# Altium schematic sheet Reader.SchDoc
size A4; SheetNumber: 2; SheetTotal: 4
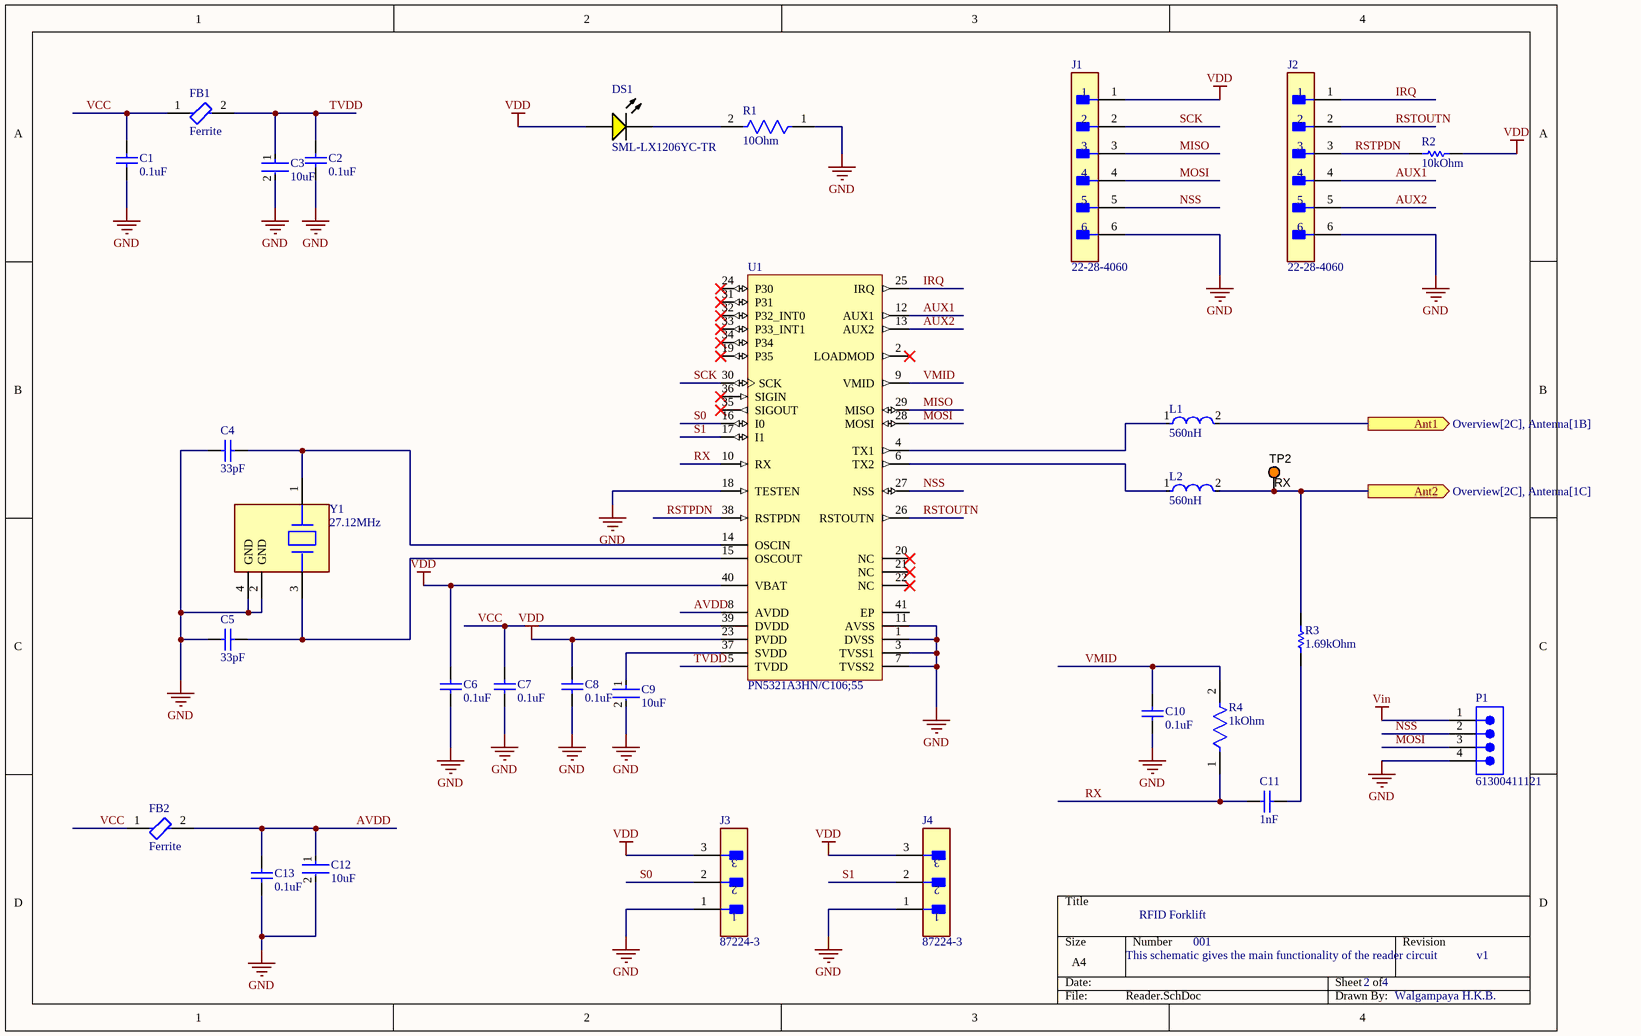
[diagram p0: Reader.SchDoc]

## Parts
C1  0.1uF  [CAPC2013X140X50LL20T25]
C2  0.1uF  [CAPC2013X140X50LL20T25]
C3  10uF  [FP-CC1206-0_3-1_45-IPC_C]
C4  33pF  [CAPC1608X90X35NL10T15]
C5  33pF  [CAPC1608X90X35NL10T15]
C6  0.1uF  [CAPC2013X140X50LL20T25]
C7  0.1uF  [CAPC2013X140X50LL20T25]
C8  0.1uF  [CAPC2013X140X50LL20T25]
C9  10uF  [FP-CC1206-0_3-1_45-IPC_C]
C10  0.1uF  [CAPC2013X140X50LL20T25]
C11  1nF  [CAPC2013X140X50LL20T25]
C12  10uF  [FP-CC1206-0_3-1_45-IPC_C]
C13  0.1uF  [CAPC2013X140X50LL20T25]
DS1  SML-LX1206YC-TR  [LUMX-SML-LX1206YC-TR_V]
FB1  Ferrite  [FP-BLM21-0_2-t0_85-e0_5-MFG]
FB2  Ferrite  [FP-BLM21-0_2-t0_85-e0_5-MFG]
J1  22-28-4060  [FP-22-28-4060-MFG]
J2  22-28-4060  [FP-22-28-4060-MFG]
J3  87224-3  [FP-87224-3-MFG]
J4  87224-3  [FP-87224-3-MFG]
L1  560nH  [FP-LQM18FN_00-IPC_C]
L2  560nH  [FP-LQM18FN_00-IPC_C]
P1  61300411121  [61300411121]
R1  10Ohm  [FP-RC0603-0_55-IPC_C]
R2  10kOhm  [RESC2013X60X35NL10T20]
R3  1.69kOhm  [RESC3116X65X40ML10T20]
R4  1kOhm  [FP-RC0603-0_55-IPC_C]
TP2  RX  [KSTN-5003]
U1  PN5321A3HN/C106;55  [NXP-HVQFN-40_L]
Y1  27.12MHz  [FP-ABM8-MFG]

## Ports
Ant1 (out, see Overview[2C], Antenna[1B]), Ant2 (out, see Overview[2C], Antenna[1C])

## Nets
GND: C1.1 C2.1 C3.2 C4.1 C5.1 C6.1 C7.1 C8.1 C9.2 C10.1 C12.2 C13.1 J1.6 J2.6 J3.1 J4.1 P1.4 R1.1 U1.1(DVSS) U1.3(TVSS1) U1.7(TVSS2) U1.11(AVSS) U1.18(TESTEN) Y1.2(GND) Y1.4(GND)
VDD: C6.2 C8.2 DS1.1(A) J1.1 J3.3 J4.3 R2.2 U1.23(PVDD) U1.40(VBAT)
Vin: P1.1
Ant1: L1.2 ; port Ant1
Ant2: L2.2 R3.2 TP2.1 ; port Ant2
AUX1: J2.4 U1.12(AUX1)
AUX2: J2.5 U1.13(AUX2)
AVDD: C12.1 C13.2 FB2.2 U1.8(AVDD)
IRQ: J2.1 U1.25(IRQ)
MISO: J1.3 U1.29(MISO)
MOSI: J1.4 P1.3 U1.28(MOSI)
NSS: J1.5 P1.2 U1.27(NSS)
RSTOUTN: J2.2 U1.26(RSTOUTN)
RSTPDN: J2.3 R2.1 U1.38(RSTPDN)
RX: C11.2 R4.1 U1.10(RX)
S0: J3.2 U1.16(I0)
S1: J4.2 U1.17(I1)
SCK: J1.2 U1.30(SCK)
TVDD: C2.2 C3.1 FB1.2 U1.5(TVDD)
VCC: C1.2 C7.2 FB1.1 FB2.1 U1.39(DVDD)
VMID: C10.2 R4.2 U1.9(VMID)
NetC4_2: C4.2 U1.14(OSCIN) Y1.1
NetC5_2: C5.2 U1.15(OSCOUT) Y1.3
NetC9_1: C9.1 U1.37(SVDD)
NetC11_1: C11.1 R3.1
NetDS1_2: DS1.2(K) R1.2
NetL1_1: L1.1 U1.4(TX1)
NetL2_1: L2.1 U1.6(TX2)

Not connected (* = marked no-connect by the designer): U1 2(LOADMOD)* 19(P35)* 20(NC)* 21(NC)* 22(NC)* 24(P30)* 31(P31)* 32(P32_INT0)* 33(P33_INT1)* 34(P34)* 35(SIGOUT)* 36(SIGIN)* 41(EP)

## Notes on the sheet
- RFID Forklift
- This schematic gives the main functionality of the reader circuit
- 001
- 2
- 4
- v1
- Walgampaya H.K.B.

## Library data of the parts
C1 C2 C6-C8 C10 C11 C13 = CMP-2007-04699-1: 08055C221KAT2A / 0805; Manufacturer: AVX Interconnect / Elco; Part Number: 08055C221KAT2A
C3 C9 C12 = CMP-2000-05436-2: CAP CER 1000PF 2KV X7R 1206; Capacitance: 1nF; Insulation Resistance: 10GR; Dissipation Factor: 2.5%; Tolerance: 10%; Termination: SMD/SMT; Voltage Rating (DC): 2kV; Case/Package: 1206; Length: 3.2mm; Depth: 1.6mm; Case Code (Imperial): 1206; Package Quantity: 1; Packaging: Tape and Reel; Dielectric: X7R; Mount: Surface Mount; Max Operating Temperature: 125°C; Lead Free: Lead Free; Number of Pins: 2; Thickness: 0.057inch; Width: 0.063inch; Resistor Type: Ceramic; Series: CC; RoHS Compliant: Yes; Voltage Rating: 2kV; Radiation Hardening: No; Construction: Flat; Height: 1.25mm; Min Operating Temperature: -55°C; Voltage: 2kV; Case Code (Metric): 3216
C4 C5 = CMP-2006-02655-1: 0603; Part Number: GRM1885C1H330GA01D; Manufacturer: Murata
DS1 = CMP-2000-07124-1: Yellow LED, Water Clear Len, 585 nm, 2.1 V, -40 to 85 degC, 2-Pin SMD, RoHS, Tape and Reel; Manufacturer: Lumex; Product Training Modules: LEDsBenefitsofCustomLEDandLCDTechnology; Millicandela Rating: 6mcd; Catalog Drawings: SML-LX1206SeriesTopSML-LX1206SeriesSideSML-LX1206SeriesBottomSML-LX1206SeriesFootprint; Wavelength - Peak: 585nm; Other Names: 67-1358-2LU60357TRSMLLX1206YCTR; Lens Style/Size: RectanglewithFlatTop; Current - Test: 20mA; Lens Color: Colorless; Viewing Angle: 160°; Voltage - Forward (Vf) (Typ): 2.1V; Online Catalog: SML-LX1206RectanglewithFlatTop1206PackageLEDs; Mounting Type: SurfaceMount; Package Description: 2-Pin Surface Mount Device, Body 3.2 x 1.5 mm; Datasheet Version: Rev. K, 08/2012; Features: -; Color: Yellow; RoHS Information: RoHSCertofCompliance; Package Reference: SML-LX1206YC-TR; Supplier Device Package: 1206; Standard Package: 3,000; Series: -; Wavelength - Dominant: -; Package / Case: 1206(3216Metric); Mounting Technology: SurfaceMount; Height (Max): 1.10mm; Lens Transparency: Clear; Datasheet URL: http://www.lumex.com/content/files/ProductAttachment/SML-LX1206YC-TR.pdf; Family: LEDIndication-Discrete; Manufacturer URL: http://www.lumexinstruments.com/; Packaging: Tape&Reel(TR); Category: Optoelectronics; Size / Dimension: 3.20mmLx1.60mmW
FB1 FB2 = CMP-0686-00645-3: Chip Ferrite Bead, 0805, 470Ω @ 100MHz, 0.18Ω, 25%, 700mA / BLM21AG471SN1D; Number of Lines: 1; Max DC Current: 200mA; Impedance: 470R; Material: Steel; DC Resistance (DCR): 190mR; Shielding: Unshielded; Min Operating Temperature: -55°C; Case Code (Metric): 2012; Series: BLM21A; Radiation Hardening: No; Lead Free: Lead Free; Tolerance: 25%; Current Rating: 700mA; Depth: 1.45mm; DC Current: 200mA; Frequency: 100MHz; Number of Pins: 2; Case Code (Imperial): 0805; REACH SVHC: No SVHC; Length: 2mm; Case/Package: 0805; Core Material: Ferrite; Width: 1.25mm; Height: 0.85mm; Package Quantity: 1; Max Operating Temperature: 125°C; DC Resistance-Max: 190MR; RoHS Compliant: Yes; Packaging: Tape and Reel; Test Frequency: 100MHz; Termination: SMD/SMT; Number of Circuits: 1; Max Current Rating: 700mA
J1 J2 = CMP-04776-000763-1: CONN HEADER VERT 6POS 2.54MM; Voltage Rating: 250V; Current Rating: 4A; Number of Contacts: 6; Max Voltage Rating (DC): 250.25kV; Gender: Male; Contact Resistance: 20mR; Connector Type: Male Pin; Color: Black; Max Voltage Rating (AC): 250V; Pitch: 2.54mm; Orientation: Straight; Max Operating Temperature: 75°C; Contact Plating: Tin; Depth: 2.49mm; Contact Type: Male Pin; Number of Positions: 6; Length: 15.24mm; Packaging: Bulk; Mount: Through Hole; Housing Material: Thermoplastic; Housing Color: Black; Termination: Solder; Contact Material: Brass; Min Operating Temperature: 0°C; Series: KK® 42375; Number of Rows: 1; Package Quantity: 1; RoHS Compliant: Yes; Contact Mating Length: 0.24inch
J3 J4 = CMP-2000-05697-2: CONN HEADER VERT 3POS 2.54MM; Number of Positions: 3; Gasket: No (Without); High Speed Serial Data Connector: No; Current Rating: 3A; Contact Post Length: 0.125inch; PCB Thickness: 1.397mm; PCB Mount Retention: Without; Connector Type: Plug; Approvals: CSA; PCB Mounting Orientation: Vertical; Pitch: 2.54mm; Mating Alignment: No (Without); Housing Color: Black; Contact Gender: Male; Length: 7.21mm; Max Operating Temperature: 105°C; Strain Relief: No (Without); Contact Material: Bronze; Row Spacing: 2.54mm; Series: AMPMODU MOD II; Board Standoff: No (Without); Package Quantity: 520; Radiation Hardening: No; Contact Protection: No (Without); Stabilizers: No (Without); Number of Rows: 1; Contact Mating Length: 8.08mm; Contact Shape: Square; Depth: 2.54mm; Contact Current Rating: 3A; Flammability Rating: UL94 V-0; Packaging: Carton; Number of Contacts: 3; Orientation: Straight; Mount: Through Hole; Keyed: No; Contact Type: Male Pin; Housing Material: Thermoplastic; High Temperature Housing: No; ELV: Compliant; Contact Plating: Gold; Termination: Through Hole; Selectively Loaded: No (Without); Lead Free: Lead Free; Min Operating Temperature: -65°C; Mating Connector Lock: No (Without); Color: Black; RoHS Compliant: Yes
L1 L2 = CMP-06042-016407-1: FIXED IND 10UH 50MA 900 MOHM SMD; Self Resonant Frequency: 30MHz; Tolerance: 20%; DC Resistance (DCR): 1.17R; Core Material: Ferrite; Shielding: Shielded; Test Frequency: 1MHz; Packaging: Tape and Reel; Max DC Current: 50mA; Depth: 0.9mm; DC Current: 50mA; Case/Package: 0603; Saturation Current: 50mA; Height - Seated (Max): 0.035inch; Package Quantity: 4000; Case Code (Metric): 1608; RoHS Compliant: Yes; Military Standard: Not; Current Rating: 50mA; Max Operating Temperature: 125°C; Height: 0.9mm; Inductance: 10uH; Series: LQM18F; Radiation Hardening: No; Lead Free: Lead Free; Termination: SMD/SMT; Length: 0.063inch; Mount: Surface Mount; Case Code (Imperial): 0603; Width: 0.031inch; Min Operating Temperature: -55°C
P1 = CMP-1502-01064-3: NexarPartId: 32855522; Operating Supply Voltage: 250V; Pitch: 2.54mm; Contact Resistance: 20mΩ; Number of Positions: 4; Current Rating: 3A; Connector Type: Male Pin; Gender: Male; Contact Plating: Gold; Height: 8.89mm; Lead Pitch: 2.54mm; Lead Free: Lead Free; Contact Mating Length: 5.9944mm; Number of Rows: 1; Termination: Solder; Packaging: Bulk; REACH SVHC: Unknown; Min Operating Temperature: -40°C; RoHS: Compliant; Number of Contacts: 4; Voltage Rating: 250V; Color: Black; Max Operating Temperature: 105°C; Contact Material: Copper; Mount: Through Hole; Orientation: Vertical; Number of Pins: 4
R1 R4 = CMP-2100-03664-2: RES 10K OHM 1% 1/10W 0603; Voltage Rating: 75V; Voltage Rating (DC): 50V; Resistance: 10kR; Power Rating: 100mW; Temperature Coefficient: 100ppm/°C; Depth: 0.8mm; Termination: SMD/SMT; Resistor Type: Thick Film; Series: RC; Construction: Rectangular; Features: Moisture Resistant; Packaging: Tape and Reel; Min Operating Temperature: -55°C; Number of Terminations: 2; Lead Pitch: 0.3mm; RoHS Compliant: Yes; Case/Package: 0603; Resistance Tolerance: 1%; Military Standard: Not; Weight: 7.1E-05oz; Number of Pins: 2; Tolerance: 1%; Length: 1.6mm; Case Code (Imperial): 0603; Lead Free: Lead Free; Width: 0.8mm; Max Power Dissipation: 100mW; Height: 0.45mm; Max Operating Temperature: 155°C; Case Code (Metric): 1608; Size Code: 0603
R2 = CMP-1659-00013-4: Chip Resistor, 10 KOhm, +/- 1%, 0.125 W, -55 to 155 degC, 0805 (2012 Metric), RoHS, Tape and Reel; Manufacturer: Yageo; Voltage Rating: 150 V; Mount: Surface Mount; ComponentLink1Description: Manufacturer URL; ComponentLink2URL: http://www.yageo.com/documents/recent/PYu-RC_Group_51_RoHS_L_04.pdf; Pins: 2; Length: 2 mm; Min Operating Temperature: -55 degC; Height: 0.5 mm; Mounting Technology: Surface Mount; RoHSCompliant: true; REACH SVHC: No SVHC; ComponentLink1URL: http://www.yageo.com/; Max Operating Temperature: 155 degC; PackageReference: 0805; DatasheetVersion: Rev. 4, 02/2016; Package Quantity: 5000; Packaging: Tape and Reel; ComponentLink2Description: Datasheet; PackageDescription: 2-Pin Surface Mounted Device, Body 2 x 1.25 mm
R3 = CMP-2100-03677-1: Chip Resistor, 10 Ohm, +/- 1%, 0.25 W, -55 to 155 degC, 1206 (3216 Metric), RoHS, Tape and Reel; Manufacturer: Yageo; Voltage Rating (DC): 200V; Resistance: 10Ohm; Power Rating: 250mW; Temperature Coefficient: 200ppm/degreesC; Military Standard: Not; Package Description: 2-Pin Surface Mount Device, Body 3.1 x 1.6 mm; Packaging: TapeandReel; Datasheet Version: Rev. 5, 10/2016; Length: 3.1mm; Manufacturer URL: http://www.yageo.com/; Voltage Rating: 200V; Height: 0.026inch; REACH SVHC: Unknown; Max Operating Temperature: 155degC; Case Code (Imperial): 1206; Package Reference: 1206.0; RoHSCompliant: true; Termination: SMD/SMT; Lead Free: LeadFree; Composition: ThickFilm; Tolerance: 1%; Package Quantity: 1; Min Operating Temperature: -55degC; Datasheet URL: http://www.yageo.com/NewPortal/yageodocoutput?fileName=/pdf/R-Chip/PYu-RC_Group_51_RoHS_L_5.pdf; Number of Pins: 2; Width: 0.063inch; Case Code (Metric): 3216; Max Power Dissipation: 250mW; Depth: 1.6mm; Number of Terminations: 2; Case/Package: 1206
TP2 = CMP-1672-00009-1: Test Point, Orange, 1-Pin THD, RoHS; Peak Reverse Current: 600 uA; Forward Current: 3 A; Max Surge Current: 80 A; Forward Voltage: 1.08 V; Max Operating Temperature: 150 degC; PackageReference: 5003; Pins: 2; ComponentLink2URL: http://keyelco.com/userAssets/file/M65p56.pdf; PackageDescription: 1-Pin Through Hole Device, Dia 2.54 mm; Weight: 0.01 lb; Diameter: 5.3 mm; Mount: Through Hole; Package Quantity: 500; Packaging: Bulk; Min Operating Temperature: -65 degC; ComponentLink1Description: Manufacturer URL; Height: 0.25 inch; ComponentLink1URL: http://www.keyelco.com/; ComponentLink2Description: Datasheet; Width: 0.25 inch; REACH SVHC: No SVHC; RoHSCompliant: true; Radiation Hardening: No; Length: 9.5 mm; DatasheetVersion: Jun-15
U1 = CMP-2000-05282-1: NFC Controller, 13.56 MHz, -30 to 85 degC, 40-Pin HVQFN (SOT618-1), RoHS, Tray; Manufacturer: NXP Semiconductors; Supply Voltage - Min: 2.7V; Supply Voltage - Max: 5.5V; Brand: NXPSemiconductors; Supply Current: 12uA; RoHS: Details; Mounting Style: SMD/SMT; Packaging: Tray; Operating Frequency: 13.56MHz; Maximum Operating Temperature: +85C; Product Category: RFWirelessMisc; Datasheet Version: Rev. 1.2, 03/2011; Type: NearFieldTransmissionModule,Read/Write; Package / Case: QFN-40; Datasheet URL: https://datasheet.ciiva.com/1172/1391932-1172875.pdf; Factory Pack Quantity: 490; Manufacturer URL: http://www.nxp.com/; Minimum Operating Temperature: -25C
Y1 = CMP-27762-000994-1: Crystal 27.12MHz ±30ppm 18pF SMD-4 3.2mm x 2.5mm / ABM8-27.120MHZ-B4-T; ESR (Equivalent Series Resistance): 50R; Frequency Stability: 50ppm; Capacitance: 1.8E-11F; Height: 0.031inch; Load Capacitance: 18pF; Width: 0.098inch; Packaging: Tape and Reel; Lead Free: Lead Free; Frequency Tolerance: 30ppm; Max Operating Temperature: 70°C; Length: 0.126inch; Case/Package: SMD/SMT; Mount: Surface Mount; Min Operating Temperature: -20°C; RoHS Compliant: Yes; Frequency: 27.12MHz